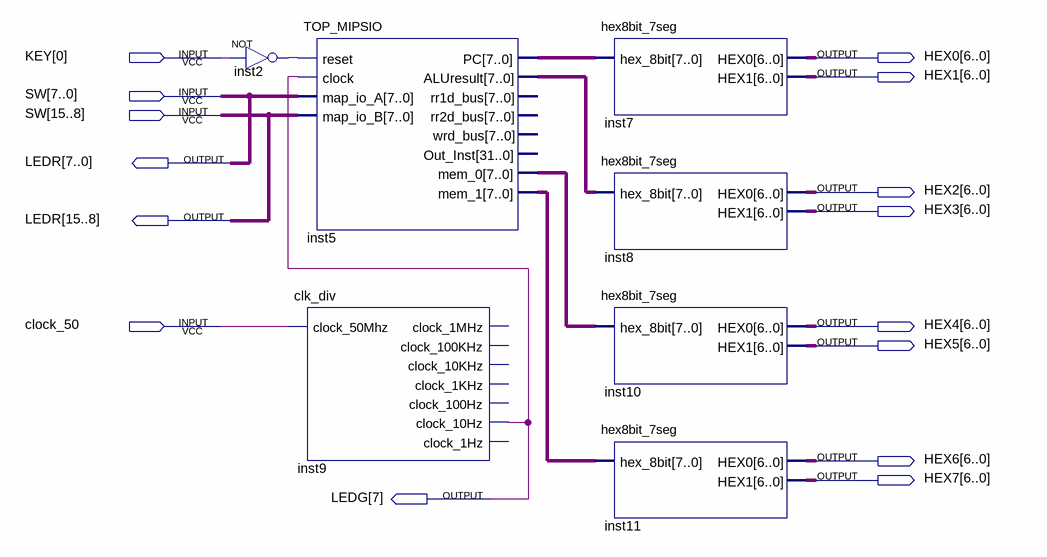
[diagram p0: schematic sheet]
// Quartus schematic MIPS_EMB.bdf as structural Verilog: 7 symbols, 15 pins
module MIPS_EMB (
  input  [0:0] KEY,
  input  [15:0] SW,
  input  clock_50,
  output [6:0] HEX0,
  output [6:0] HEX1,
  output [15:0] LEDR,
  output [6:0] HEX2,
  output [6:0] HEX3,
  output [6:0] HEX4,
  output [6:0] HEX5,
  output [6:0] HEX6,
  output [6:0] HEX7,
  output [7:7] LEDG
);

  wire inst2_out;
  wire [7:0] inst5_aluresult, inst5_mem_0, inst5_mem_1, inst5_pc;

  not inst2 (inst2_out, KEY[0]);
  TOP_MIPSIO inst5 (
    .reset(inst2_out), .clock(LEDG[7]), .map_io_A(SW[7:0]), .map_io_B(SW[15:8]), .PC(inst5_pc),
    .ALUresult(inst5_aluresult), .mem_0(inst5_mem_0), .mem_1(inst5_mem_1));  // open: rr1d_bus, rr2d_bus, wrd_bus, Out_Inst
  clk_div inst9 (
    .clock_50Mhz(clock_50), .clock_10Hz(LEDG[7]));  // open: clock_1MHz, clock_100KHz, clock_10KHz, clock_1KHz, clock_100Hz, clock_1Hz
  hex8bit_7seg inst7 (.hex_8bit(inst5_pc), .HEX0(HEX0), .HEX1(HEX1));
  hex8bit_7seg inst8 (.hex_8bit(inst5_aluresult), .HEX0(HEX2), .HEX1(HEX3));
  hex8bit_7seg inst10 (.hex_8bit(inst5_mem_0), .HEX0(HEX4), .HEX1(HEX5));
  hex8bit_7seg inst11 (.hex_8bit(inst5_mem_1), .HEX0(HEX6), .HEX1(HEX7));

  assign LEDR = SW;
endmodule
